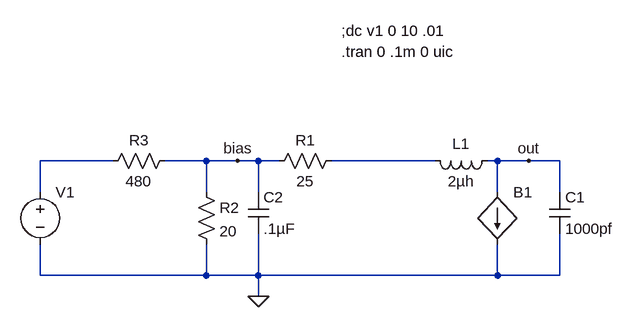
[diagram p0: schematic NegResistanceOsc.asc]
NegResistanceOsc.asc, the LTspice schematic file:
Version 4
SHEET 1 1032 680
WIRE -432 192 -432 144
WIRE -432 320 -432 272
WIRE -320 144 -432 144
WIRE -176 144 -240 144
WIRE -176 192 -176 144
WIRE -176 320 -432 320
WIRE -176 320 -176 272
WIRE -128 144 -176 144
WIRE -96 144 -128 144
WIRE -96 192 -96 144
WIRE -96 320 -176 320
WIRE -96 320 -96 256
WIRE -96 352 -96 320
WIRE -64 144 -96 144
WIRE 176 144 16 144
WIRE 272 144 256 144
WIRE 272 192 272 144
WIRE 272 320 -96 320
WIRE 272 320 272 272
WIRE 320 144 272 144
WIRE 368 144 320 144
WIRE 368 192 368 144
WIRE 368 320 272 320
WIRE 368 320 368 256
FLAG -96 352 0
FLAG 320 144 out
FLAG -128 144 bias
SYMBOL bi 272 192 R0
WINDOW 3 24 88 Invisible 0
SYMATTR Value I=table(v(out),0,0,.1,.002,.2,.0005,1,.01)
SYMATTR InstName B1
SYMBOL voltage -432 176 R0
WINDOW 3 24 104 Invisible 0
WINDOW 123 0 0 Left 0
WINDOW 39 0 0 Left 0
SYMATTR Value PULSE(0 5 0 10u 1u 0.49 .5)
SYMATTR InstName V1
SYMBOL res 32 128 R90
WINDOW 0 0 56 VBottom 0
WINDOW 3 32 56 VTop 0
SYMATTR InstName R1
SYMATTR Value 25
SYMBOL cap 352 192 R0
SYMATTR InstName C1
SYMATTR Value 1000pf
SYMBOL ind 272 128 R90
WINDOW 0 5 56 VBottom 0
WINDOW 3 32 56 VTop 0
SYMATTR InstName L1
SYMATTR Value 2µh
SYMBOL cap -112 192 R0
SYMATTR InstName C2
SYMATTR Value .1µF
SYMBOL res -192 176 R0
SYMATTR InstName R2
SYMATTR Value 20
SYMBOL res -224 128 R90
WINDOW 0 0 56 VBottom 0
WINDOW 3 32 56 VTop 0
SYMATTR InstName R3
SYMATTR Value 480
TEXT 32 -24 Left 0 !.tran 0 .1m 0 uic
TEXT 32 -56 Left 0 !;dc v1 0 10 .01

The netlist it stands for:
* NegResistanceOsc.asc
B1 out 0 I=table(v(out),0,0,.1,.002,.2,.0005,1,.01)
V1 N001 0 PULSE(0 5 0 10u 1u 0.49 .5)
R1 N002 bias 25
C1 out 0 1000pf
L1 out N002 2µh
C2 bias 0 .1µF
R2 bias 0 20
R3 bias N001 480
.tran 0 .1m 0 uic
;dc v1 0 10 .01
.backanno
.end